# Altium schematic sheet 基于51单片机超声波测距系统.SchDoc
size A4
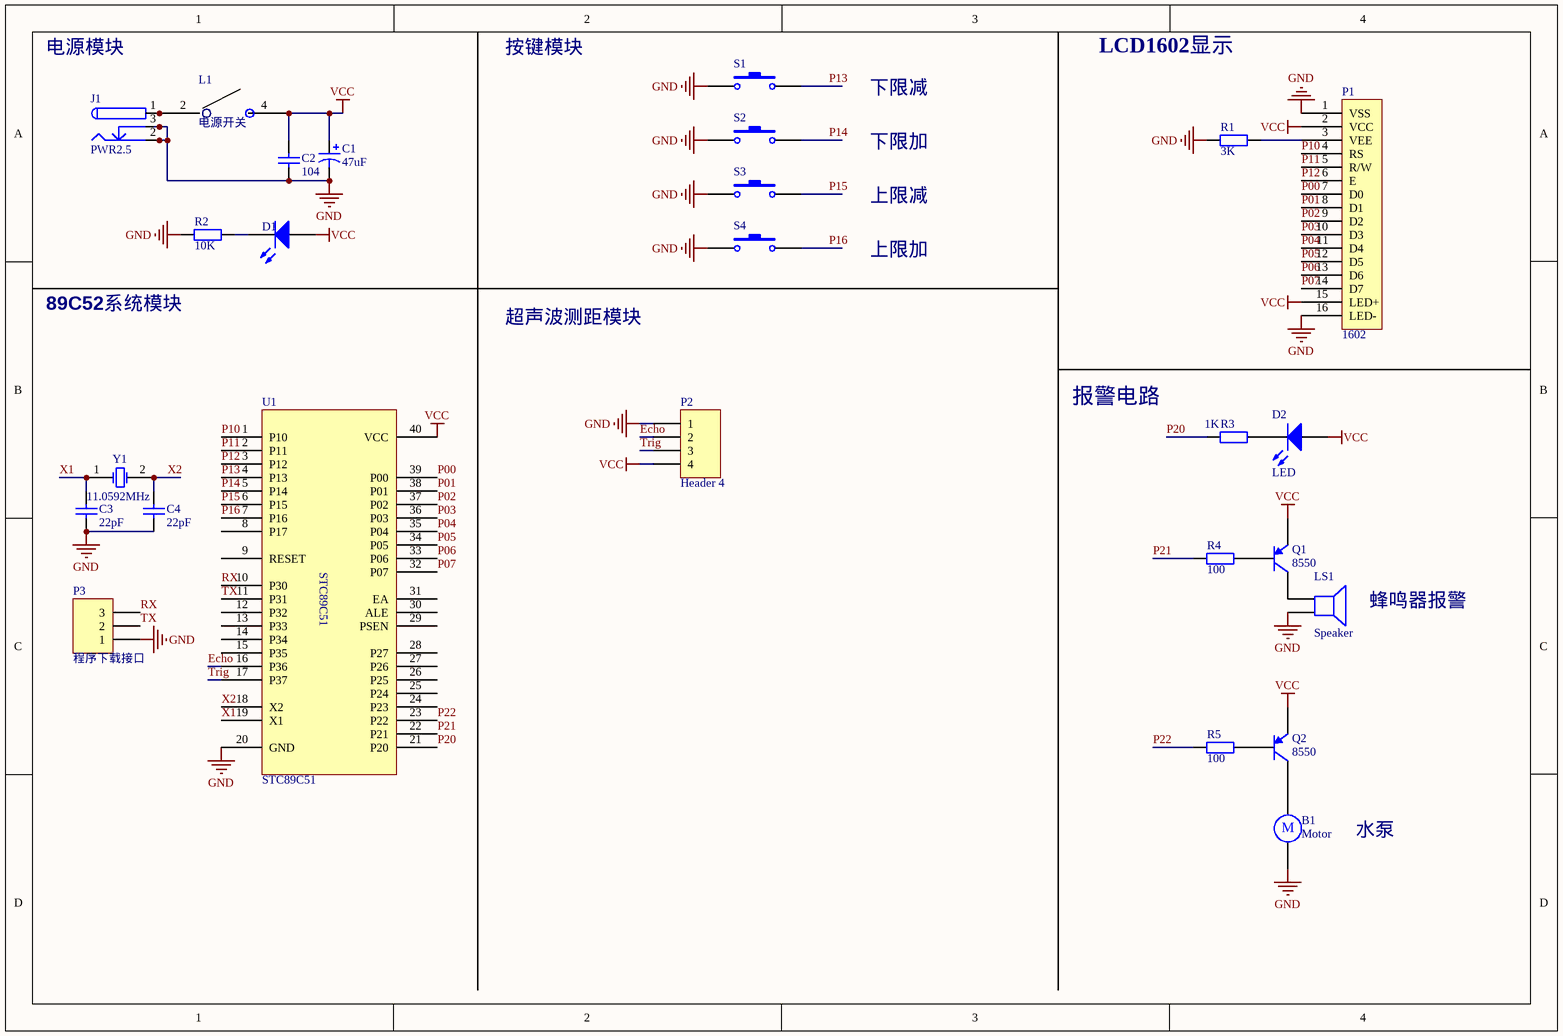
[diagram p0: 基于51单片机超声波测距系统.SchDoc]

## Parts
B1  Motor  [2p座]
C1  47uF  [电解电容]
C2  104  [瓷片电容]
C3  22pF  [瓷片电容]
C4  22pF  [瓷片电容]
D1  LED  [发光二极管]  (value not drawn)
D2  LED  [发光二极管]
J1  PWR2.5  [电源接头]
L1  电源开关  [开关]
LS1  Speaker  [蜂鸣器]
P1  1602  [LCD1602液晶]
P2  Header 4  [4P座]
P3  程序下载接口  [下载器]
Q1  8550  [三极管]
Q2  8550  [三极管]
R1  3K  [电阻]
R2  10K  [电阻]
R3  1K  [电阻]
R4  100  [电阻]
R5  100  [电阻]
S1  (no value)  [按键]
S2  (no value)  [按键]
S3  (no value)  [按键]
S4  (no value)  [按键]
U1  STC89C51  [51单片机]
Y1  11.0592MHz  [晶振]

## Nets
GND: B1.2 C1.2 C2.1 C3.1 C4.1 J1.2 J1.2A J1.2B J1.3 J1.3A J1.3B LS1.2 P1.1(VSS) P1.16(LED-) P2.1 P3.1 R1.1 R2.1 S1.1 S2.1 S3.1 S4.1 U1.20(GND)
VCC: C1.1 C2.2 D1.1(A) D2.1(A) L1.4 P1.2(VCC) P1.15(LED+) P2.4 Q1.1(E) Q2.1(E) U1.40(VCC)
Echo: P2.2 U1.16(P36)
P00: P1.7(D0) U1.39(P00)
P01: P1.8(D1) U1.38(P01)
P02: P1.9(D2) U1.37(P02)
P03: P1.10(D3) U1.36(P03)
P04: P1.11(D4) U1.35(P04)
P05: P1.12(D5) U1.34(P05)
P06: P1.13(D6) U1.33(P06)
P07: P1.14(D7) U1.32(P07)
P10: P1.4(RS) U1.1(P10)
P11: P1.5(R/W) U1.2(P11)
P12: P1.6(E) U1.3(P12)
P13: S1.2 U1.4(P13)
P14: S2.2 U1.5(P14)
P15: S3.2 U1.6(P15)
P16: S4.2 U1.7(P16)
P20: R3.1 U1.21(P20)
P21: R4.1 U1.22(P21)
P22: R5.1 U1.23(P22)
RX: P3.3 U1.10(P30)
Trig: P2.3 U1.17(P37)
TX: P3.2 U1.11(P31)
X1: C3.2 U1.19(X1) Y1.1(OSC1)
X2: C4.2 U1.18(X2) Y1.2(OSC2)
NetB1_1: B1.1 Q2.3(C)
NetD1_2: D1.2(K) R2.2
NetD2_2: D2.2(K) R3.2
NetJ1_1: J1.1 J1.1A J1.1B L1.2
NetLS1_1: LS1.1 Q1.3(C)
NetP1_3: P1.3(VEE) R1.2
NetQ1_2: Q1.2(B) R4.2
NetQ2_2: Q2.2(B) R5.2

Not connected (* = marked no-connect by the designer): U1 8(P17) 9(RESET) 12(P32) 13(P33) 14(P34) 15(P35) 24(P23) 25(P24) 26(P25) 27(P26) 28(P27) 29(PSEN) 30(ALE) 31(EA)

## Notes on the sheet
- 电源模块
- 按键模块
- 下限减
- LCD1602显示
- 下限加
- 上限减
- 89C52系统模块
- 上限加
- 超声波测距模块
- 报警电路
- 蜂鸣器报警
- 水泵
- (in symbol Motor) M

## Library data of the parts
B1 = Motor: Motor, General Kind; Published: 24-Mar-1999; LatestRevisionDate: 17-Jul-2002; LatestRevisionNote: Re-released for DXP Platform.; PackageReference: RB5-10.5; Publisher: Altium Limited
C1 = Cap Pol1: Polarized Capacitor (Radial); Published: 8-Jun-2000; LatestRevisionDate: 17-Jul-2002; LatestRevisionNote: Re-released for DXP Platform.; PackageReference: RB7.6-15; Publisher: Altium Limited; Value: 47uF
C2-C4 = Cap: Capacitor; Published: 8-Jun-2000; LatestRevisionDate: 17-Jul-2002; LatestRevisionNote: Re-released for DXP Platform.; PackageReference: RAD-0.3; Publisher: Altium Limited
  C2: Value: 104
  C3 C4: Value: 22pF
D1 D2 = LED0: Typical INFRARED GaAs LED; Published: 8-Jun-2000; LatestRevisionDate: 08-Jul-2005; LatestRevisionNote: Mech Layer 1 removed.; PackageReference: LED-0; Publisher: Altium Limited
J1 = PWR2.5: Low Voltage Power Supply Connector; Published: 17-Dec-2003; DatasheetDocument: 09-May-2002; Publisher: Altium Limited; ComponentLink1Description: Manufacturer Link; ComponentLink1URL: http://domino.kycon.com/internet/Products.html
L1 = Liujiao
LS1 = Speaker: Loudspeaker; Published: 24-Mar-1999; LatestRevisionDate: 17-Jul-2002; LatestRevisionNote: Re-released for DXP Platform.; PackageReference: PIN2; Publisher: Altium Limited
P2 = Header 4: Header, 4-Pin; LatestRevisionDate: 17-Jul-2002; LatestRevisionNote: Re-released for DXP Platform.; Publisher: Altium Limited
P3 = Header 3: Header, 3-Pin; LatestRevisionDate: 17-Jul-2002; LatestRevisionNote: Re-released for DXP Platform.; Publisher: Altium Limited
Q1 Q2 = 2N3906: PNP General Purpose Amplifier; Published: 8-Jun-2000; LatestRevisionDate: 15-Jan-2003; LatestRevisionNote: PCB Footprint 'BCY-W3/D4.7' replaced; DatasheetDocument: 1997; PackageDocument: Sep-1998; PackageReference: TO-92A; Publisher: Altium Limited; Code_JEDEC: TO-92A; ComponentLink1Description: Manufacturer Link; ComponentLink1URL: http://www.fairchildsemi.com/; ComponentLink2Description: Datasheet; ComponentLink2URL: http://www.fairchildsemi.com/ds/2N%2F2N3906.pdf
R1-R5 = Res2: Resistor; Published: 8-Jun-2000; LatestRevisionDate: 17-Jul-2002; LatestRevisionNote: Re-released for DXP Platform.; PackageReference: AXIAL-0.4; Publisher: Altium Limited
  R1: Value: 3K
  R2: Value: 10K
  R3: Value: 1K
  R4 R5: Value: 100
S1-S4 = SW-PB: Switch; Published: 24-Mar-1999; LatestRevisionDate: 17-Jul-2002; LatestRevisionNote: Re-released for DXP Platform.; PackageReference: SPST-2; Publisher: Altium Limited
U1 = STC89C52
Y1 = XTAL: Crystal Oscillator; Published: 8-Jun-2000; LatestRevisionDate: 17-Jul-2002; LatestRevisionNote: Re-released for DXP Platform.; PackageReference: R38; Publisher: Altium Limited